# EAGLE design mosfet (EAGLE 6.6.0)
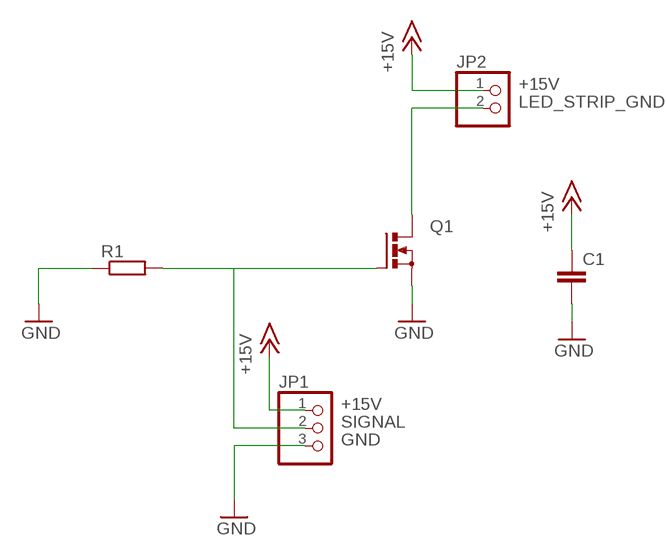
[diagram p0: schematic, sheet 1]

## Parts
C1  C-EU050-025X075  [C050-025X075]
JP1  PINHD-1X3  [1X03]
JP2  PINHD-1X2  [1X02]
Q1  PMOSFET_NTO220BV  [TO220BV]
R1  R-EU_M0805  [M0805]

## Nets
+15V: C1.1 JP1.1 JP2.1
GND: C1.2 JP1.3 Q1.S R1.1
LED_STRIP_GND: JP2.2 Q1.D
SIGNAL: JP1.2 Q1.G R1.2

## Library data of the parts
C1 = rcl:C-EU: CAPACITOR, European symbol
JP1 = pinhead:PINHD-1X3: PIN HEADER
JP2 = pinhead:PINHD-1X2: PIN HEADER
Q1 = transistor-power:PMOSFET_N: Power MOSFET N-Channel
R1 = resistor:R-EU_: RESISTOR, European symbol

## Board
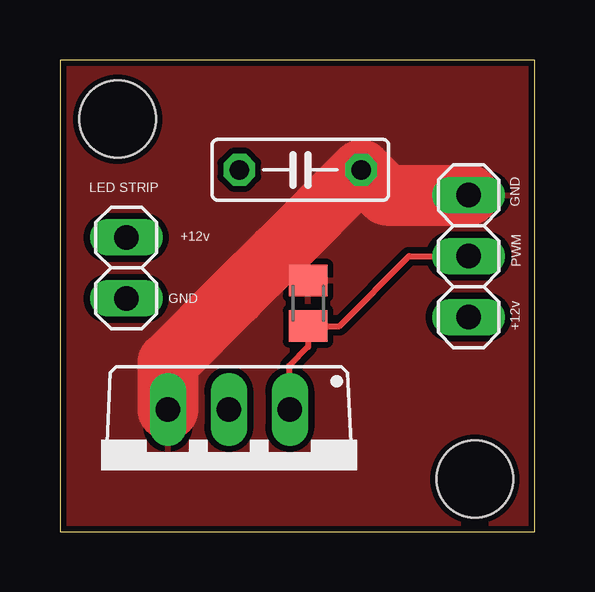
[diagram p1: board, top side]
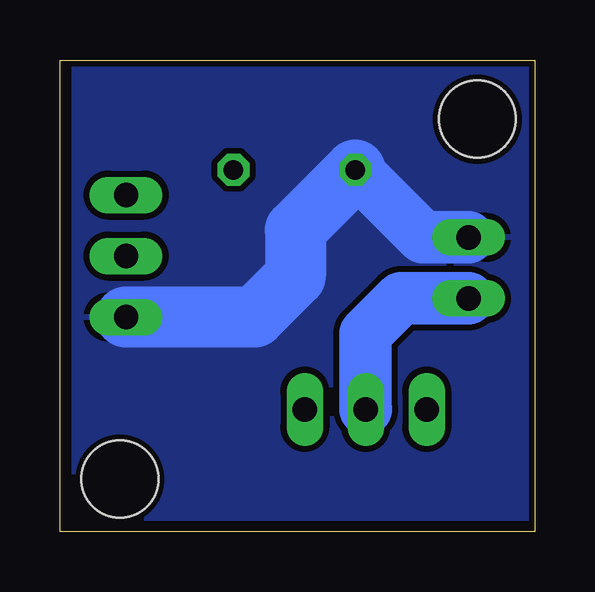
[diagram p2: board, bottom side, seen from below]

Size 19.8 x 19.66 mm. Coordinates in mm from the lower left corner, seen from the top.
Outline: 0,0 19.8,0 19.8,19.66 0,19.66 0,0
Copper layers (1*16): Top 0.035mm / dielectric 1.5mm / Bottom 0.035mm
Design rules "ITEADstudio_DRC *": minimum track width 6mil, minimum drill 12mil, track to track 10mil, track to pad 10mil, pad to pad 10mil, via to via 10mil, smd to smd 0mil, copper to edge 10mil, drill to drill 10mil, minimum pad ring 10mil, minimum via ring 6mil, stop-mask expansion 2mil, vias tented up to drill 100mil, thermal gap 10mil
Holes 3.2 mm at 2.4,17.2 17.3,2.2

### Footprints (pad centres in the part's own frame; a part is rotated, then mirrored left to right if it is on the bottom)
C050-025X075 = drill 0.813 octagon: 1 -2.54,0; 2 2.54,0
1X03 = drill 1.016 long: 1 -2.54,0; 2 0,0; 3 2.54,0
1X02 = drill 1.016 long: 1 -1.27,0; 2 1.27,0
TO220BV = drill 1.016 long: D 0,-2.54; G -2.54,-2.54; S 2.54,-2.54
M0805 = smd 1.3 x 1.6: 1 -0.95,0; 2 0.95,0

### Placement (x,y rotation side)
C1  10.02,15.09 0 top
JP1  17.04,11.49 90 top
JP2  2.77,10.99 270 top
Q1  7.05,2.56 180 top
R1  10.35,9.52 270 top

### Tracks (layer width: path | path; a pad name or v marks a point on that pad's centre or on a via)
+15V
  Bottom 2.184: JP2.1 4.66,12.27 C1.1
  Bottom 2.54: C1.1 9.98,12.59 9.98,10.64 11.68,8.95 JP1.1
  pour Bottom: 0.23,19.48 0.23,0.56 19.18,0.56 19.18,19.48
GND
  Top 0.254: R1.1 10.23,10.47 9.09,11.61
  Top 2.54: JP1.3 13.62,14.03 C1.2 9.09,11.61 7.31,9.83 7.29,9.83 4.51,7.05 Q1.S
  pour Top: 0.23,19.46 0.23,0.2 19.53,0.2 19.53,19.46
LED_STRIP_GND
  Bottom 2.184: JP2.2 5.59,9.72 7.06,8.26 7.06,5.12 Q1.D
SIGNAL
  Top 0.254: Q1.G 9.55,5.14 9.55,6.91 10.35,7.71 R1.2 11.65,8.57 14.56,11.49 JP1.2

### Text on the board
tNames: LED STRIP | GND | +12v | PWM | GND | +12v